# Altium schematic sheet ШЮГИ.468262.004 Э3 Л3.SchDoc
size 219 x 307 mm; Address1: 4; DocumentNumber: ШЮГИ.468262.004 Э3; SheetNumber: 3; PP: ШЮГИ.000000.000; TypeD: Схема электрическая принципиальная; Boss: Начальник; VA: КИА; Custom: Заказ; Device: Наим.прибора; PZ: ПЗ68; Visa1: Визирующий1; Visa2: Визирующий2; Visa3: Визирующий3; Visa4: Визирующий4; Visa5: Визирующий5; Visa6: Визирующий6; DateVisa1: 11.11.11; DateVisa2: 11.11.11; DateVisa3: 11.11.11; DateVisa4: 11.11.11; DateVisa5: 11.11.11; DateVisa6: 11.11.11; DepVisa1: XXX; DepVisa2: XXX; DepVisa3: XXX; DepVisa4: XXX; DepVisa5: XXX; DepVisa6: XXX; Lit1: О; Lit2: О1; Lit3: А; Name: Наименование изделия
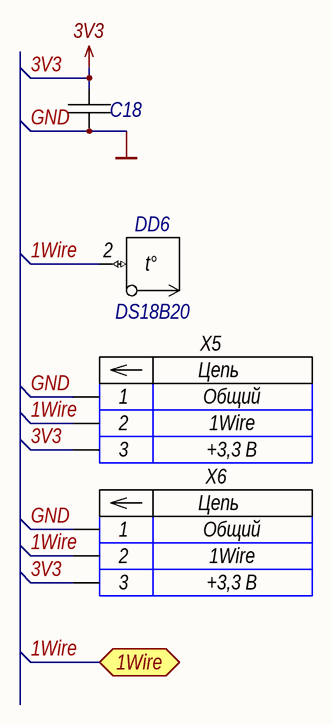
[diagram p0: ШЮГИ.468262.004 Э3 Л3.SchDoc]

## Parts
C18  0603B104J500CT Thunder  [C0603]  (value not drawn)
DD6  DS18B20 UTD Semiconductor Co.,Ltd  [TO-92-3]  (value not drawn)
X6  DS1021-01-1*3SSF112  [PLS-3]  (value not drawn)  (parts A,B,C of 3)
X7  DS1021-01-1*3SSF112  [PLS-3]  (value not drawn)  (parts A,B,C of 3)

## Ports
1Wire (bidir)

## Nets
3V3: C18.1 DD6.3(VCC) X6.3 X7.3
GND: C18.2 DD6.1(GND) X6.1 X7.1
1Wire: DD6.2(t°) X6.2 X7.2 ; port 1Wire

## Notes on the sheet
- X5
- Цепь
- Общий
- 1Wire
- +3,3 В
- X6
- Лист
- Копировал
- Изм
- № докум.
- Подп.
- Дата
- Формат А4

## Library data of the parts
C18 = 0603B104J500CT: ТИП: Конденсатор; Value: 0,1 uF; Power: 50 V; Perk: ±5 %; Mark: 104; Диэлектрик: X7R; Part Number: 0603B104J500CT; ValueBOM: 0603B104J500CT Thunder; ValueSCH: 0603B104J500CT; ГОСТ: Thunder
DD6 = DS18B20: ТИП: Микросхема; Интерфейс: 1-wire; Part Number: DS18B20; ValueSCH: DS18B20; ValueBOM: DS18B20 UTD Semiconductor Co.,Ltd; ГОСТ: UTD Semiconductor Co.,Ltd
X6 X7 = DS1021-01-1*3SSF112: ValueBOM: DS1021-01-1*3SSF112 Connfly electronic; ГОСТ: Connfly electronic; ТИП: Соединитель; Part Number: DS1021-01-1*3SSF112; ValueSCH: DS1021-01-1*3SSF112